# Altium schematic sheet Hub.SchDoc
size A4
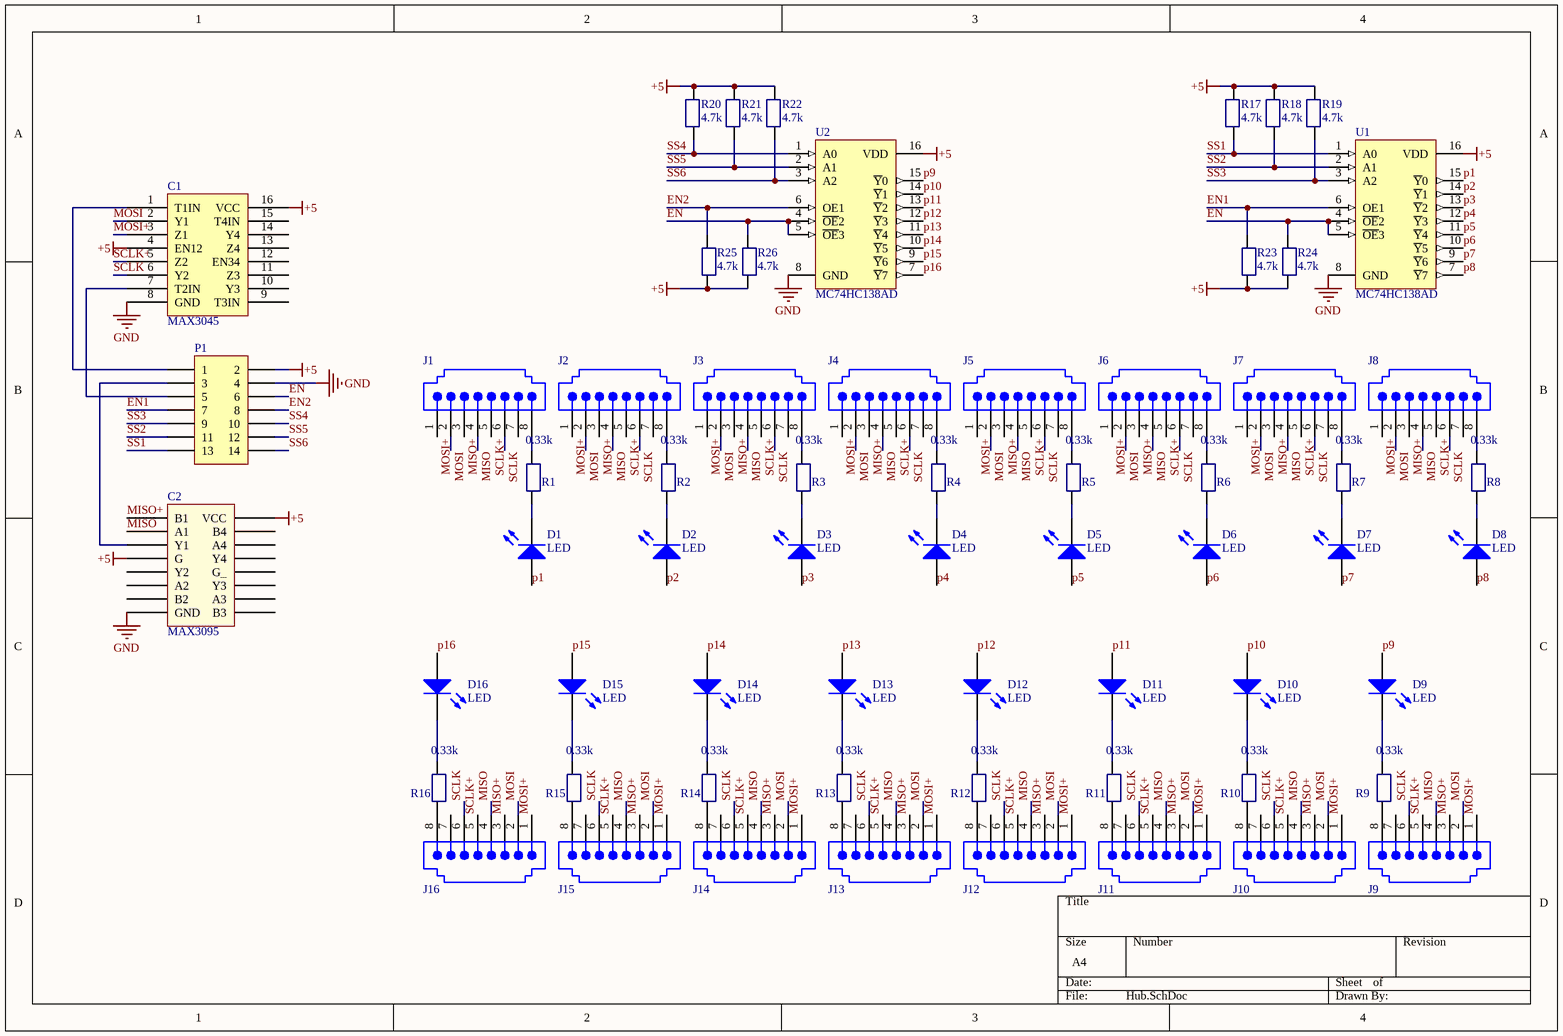
[diagram p0: Hub.SchDoc]

## Parts
C1  MAX3045  [SOP16]
C2  MAX3095  [SOP16]
D1  LED  [3.5X2.8X1.9]
D2  LED  [3.5X2.8X1.9]
D3  LED  [3.5X2.8X1.9]
D4  LED  [3.5X2.8X1.9]
D5  LED  [3.5X2.8X1.9]
D6  LED  [3.5X2.8X1.9]
D7  LED  [3.5X2.8X1.9]
D8  LED  [3.5X2.8X1.9]
D9  LED  [3.5X2.8X1.9]
D10  LED  [3.5X2.8X1.9]
D11  LED  [3.5X2.8X1.9]
D12  LED  [3.5X2.8X1.9]
D13  LED  [3.5X2.8X1.9]
D14  LED  [3.5X2.8X1.9]
D15  LED  [3.5X2.8X1.9]
D16  LED  [3.5X2.8X1.9]
J1  15-43-6233  [15-43-6233]  (value not drawn)
J2  15-43-6233  [15-43-6233]  (value not drawn)
J3  15-43-6233  [15-43-6233]  (value not drawn)
J4  15-43-6233  [15-43-6233]  (value not drawn)
J5  15-43-6233  [15-43-6233]  (value not drawn)
J6  15-43-6233  [15-43-6233]  (value not drawn)
J7  15-43-6233  [15-43-6233]  (value not drawn)
J8  15-43-6233  [15-43-6233]  (value not drawn)
J9  15-43-6233  [15-43-6233]  (value not drawn)
J10  15-43-6233  [15-43-6233]  (value not drawn)
J11  15-43-6233  [15-43-6233]  (value not drawn)
J12  15-43-6233  [15-43-6233]  (value not drawn)
J13  15-43-6233  [15-43-6233]  (value not drawn)
J14  15-43-6233  [15-43-6233]  (value not drawn)
J15  15-43-6233  [15-43-6233]  (value not drawn)
J16  15-43-6233  [15-43-6233]  (value not drawn)
P1  Header 7X2  [HDR1X14]  (value not drawn)
R1  0.33k  [R0805]
R2  0.33k  [R0805]
R3  0.33k  [R0805]
R4  0.33k  [R0805]
R5  0.33k  [R0805]
R6  0.33k  [R0805]
R7  0.33k  [R0805]
R8  0.33k  [R0805]
R9  0.33k  [R0805]
R10  0.33k  [R0805]
R11  0.33k  [R0805]
R12  0.33k  [R0805]
R13  0.33k  [R0805]
R14  0.33k  [R0805]
R15  0.33k  [R0805]
R16  0.33k  [R0805]
R17  4.7k  [R0805]
R18  4.7k  [R0805]
R19  4.7k  [R0805]
R20  4.7k  [R0805]
R21  4.7k  [R0805]
R22  4.7k  [R0805]
R23  4.7k  [R0805]
R24  4.7k  [R0805]
R25  4.7k  [R0805]
R26  4.7k  [R0805]
U1  MC74HC138AD  [751B-03_L]
U2  MC74HC138AD  [751B-03_L]

## Nets
+5: C1.4(EN12) C1.16(VCC) C2.4(G) C2.16(VCC) P1.2 R17.1 R18.1 R19.1 R20.1 R21.1 R22.1 R23.1 R24.1 R25.1 R26.1 U1.16(VDD) U2.16(VDD)
GND: C1.8(GND) C2.8(GND) P1.4 U1.8(GND) U2.8(GND)
EN: P1.6 R24.2 R26.2 U1.4(~{OE}2) U1.5(~{OE}3) U2.4(~{OE}2) U2.5(~{OE}3)
EN1: P1.7 R23.2 U1.6(OE1)
EN2: P1.8 R25.2 U2.6(OE1)
MISO: C2.2(A1) J1.4 J2.4 J3.4 J4.4 J5.4 J6.4 J7.4 J8.4 J9.4 J10.4 J11.4 J12.4 J13.4 J14.4 J15.4 J16.4
MISO+: C2.1(B1) J1.3 J2.3 J3.3 J4.3 J5.3 J6.3 J7.3 J8.3 J9.3 J10.3 J11.3 J12.3 J13.3 J14.3 J15.3 J16.3
MOSI: C1.2(Y1) J1.2 J2.2 J3.2 J4.2 J5.2 J6.2 J7.2 J8.2 J9.2 J10.2 J11.2 J12.2 J13.2 J14.2 J15.2 J16.2
MOSI+: C1.3(Z1) J1.1 J2.1 J3.1 J4.1 J5.1 J6.1 J7.1 J8.1 J9.1 J10.1 J11.1 J12.1 J13.1 J14.1 J15.1 J16.1
p1: D1.1(A) U1.15(~{Y}0)
p2: D2.1(A) U1.14(~{Y}1)
p3: D3.1(A) U1.13(~{Y}2)
p4: D4.1(A) U1.12(~{Y}3)
p5: D5.1(A) U1.11(~{Y}4)
p6: D6.1(A) U1.10(~{Y}5)
p7: D7.1(A) U1.9(~{Y}6)
p8: D8.1(A) U1.7(~{Y}7)
p9: D9.1(A) U2.15(~{Y}0)
p10: D10.1(A) U2.14(~{Y}1)
p11: D11.1(A) U2.13(~{Y}2)
p12: D12.1(A) U2.12(~{Y}3)
p13: D13.1(A) U2.11(~{Y}4)
p14: D14.1(A) U2.10(~{Y}5)
p15: D15.1(A) U2.9(~{Y}6)
p16: D16.1(A) U2.7(~{Y}7)
SCLK: C1.6(Y2) J1.6 J2.6 J3.6 J4.6 J5.6 J6.6 J7.6 J8.6 J9.6 J10.6 J11.6 J12.6 J13.6 J14.6 J15.6 J16.6
SCLK+: C1.5(Z2) J1.5 J2.5 J3.5 J4.5 J5.5 J6.5 J7.5 J8.5 J9.5 J10.5 J11.5 J12.5 J13.5 J14.5 J15.5 J16.5
SS1: P1.13 R17.2 U1.1(A0)
SS2: P1.11 R18.2 U1.2(A1)
SS3: P1.9 R19.2 U1.3(A2)
SS4: P1.10 R20.2 U2.1(A0)
SS5: P1.12 R21.2 U2.2(A1)
SS6: P1.14 R22.2 U2.3(A2)
NetC1_1: C1.1(T1IN) P1.1
NetC1_7: C1.7(T2IN) P1.5
NetC2_3: C2.3(Y1) P1.3
NetD1_2: D1.2(K) R1.1
NetD2_2: D2.2(K) R2.1
NetD3_2: D3.2(K) R3.1
NetD4_2: D4.2(K) R4.1
NetD5_2: D5.2(K) R5.1
NetD6_2: D6.2(K) R6.1
NetD7_2: D7.2(K) R7.1
NetD8_2: D8.2(K) R8.1
NetD9_2: D9.2(K) R9.2
NetD10_2: D10.2(K) R10.2
NetD11_2: D11.2(K) R11.2
NetD12_2: D12.2(K) R12.2
NetD13_2: D13.2(K) R13.2
NetD14_2: D14.2(K) R14.2
NetD15_2: D15.2(K) R15.2
NetD16_2: D16.2(K) R16.2
NetJ1_8: J1.8 R1.2
NetJ2_8: J2.8 R2.2
NetJ3_8: J3.8 R3.2
NetJ4_8: J4.8 R4.2
NetJ5_8: J5.8 R5.2
NetJ6_8: J6.8 R6.2
NetJ7_8: J7.8 R7.2
NetJ8_8: J8.8 R8.2
NetJ9_8: J9.8 R9.1
NetJ10_8: J10.8 R10.1
NetJ11_8: J11.8 R11.1
NetJ12_8: J12.8 R12.1
NetJ13_8: J13.8 R13.1
NetJ14_8: J14.8 R14.1
NetJ15_8: J15.8 R15.1
NetJ16_8: J16.8 R16.1

Not connected (* = marked no-connect by the designer): C1 9(T3IN) 10(Y3) 11(Z3) 12(EN34) 13(Z4) 14(Y4) 15(T4IN); C2 5(Y2) 6(A2) 7(B2) 9(B3) 10(A3) 11(Y3) 12(G_) 13(Y4) 14(A4) 15(B4); J1 7; J2 7; J3 7; J4 7; J5 7; J6 7; J7 7; J8 7; J9 7; J10 7; J11 7; J12 7; J13 7; J14 7; J15 7; J16 7

## Library data of the parts
D1-D16 = LED3: Typical BLUE SiC LED; Published: 8-Jun-2000; LatestRevisionDate: 17-Dec-2003; LatestRevisionNote: PCB Footprint replaced.; DatasheetVersion: 16-Apr-2002; PackageVersion: 16-Apr-2002; PackageReference: 3.5X2.8X1.9; Publisher: Altium Limited; PackageDescription: SM LED; 2 C-Bend Leads; Body 3.5 x 2.8 x 1.9 mm, inc leads (LxWxH typ)
J1-J16 = 15-43-6233: Right Angle, Standard Profile, RJ45-Keyed, Flange Mount PCB Jack; Ports: 1; Positions/Loaded: Port1 - 8 Keyed/8; PerformanceCategory: 3; PCB_Mounting: Thru-Hole; ComponentAvailability: Obsolete; DrillSize: Nominal, Rounded to nearest 0.05mm; PCB_Layout: Complies with Manufacturer's Recommendation.; Published: 25-Jun-2002; DatasheetDocument: 18-Dec-2001; PackageDocument: 18-Dec-2001; PackageReference: 15-43-6233; Publisher: Altium Limited; ComponentLink1Description: Manufacturer Link; ComponentLink1URL: http://www.molex.com/; ComponentLink2Description: Datasheet; ComponentLink2URL: http://www.molex.com/cmc_upload/common_files/1212003_catalogmx41314.pdf; ComponentLink3Description: Iges Model; ComponentLink3URL: http://www.molex.com/pdm_docs/igs/15-43-6233_igs.zip
P1 = Header 7X2: Header, 7-Pin, Dual row; LatestRevisionDate: 17-Jul-2002; LatestRevisionNote: Re-released for DXP Platform.; Publisher: Altium Limited
R1-R26 = Resistance
U1 U2 = MC74HC138AD: 1-of-8 Decoder/Demultiplexer; Published: 17-Jul-2002; LatestRevisionDate: 13-Apr-2006; LatestRevisionNote: IPC-7351 Footprint Added.; DatasheetVersion: 1989; PackageVersion: 1991; PackageReference: 751B-03; Publisher: Altium Limited; PackageDescription: 16-Pin Small Outline Integrated Circuit 1.27 mm Pitch; Code_JEDEC: MS-012-AC; Code_IPC: SOIC127P600-16; ComponentLink1Description: Manufacturer Link; ComponentLink1URL: http://www.onsemi.com/site/products/parametrics/0,4446,419,00.html; ComponentLink2Description: Datasheet; ComponentLink2URL: http://www.onsemi.com/pub/Collateral/MC74HC138A-D.PDF